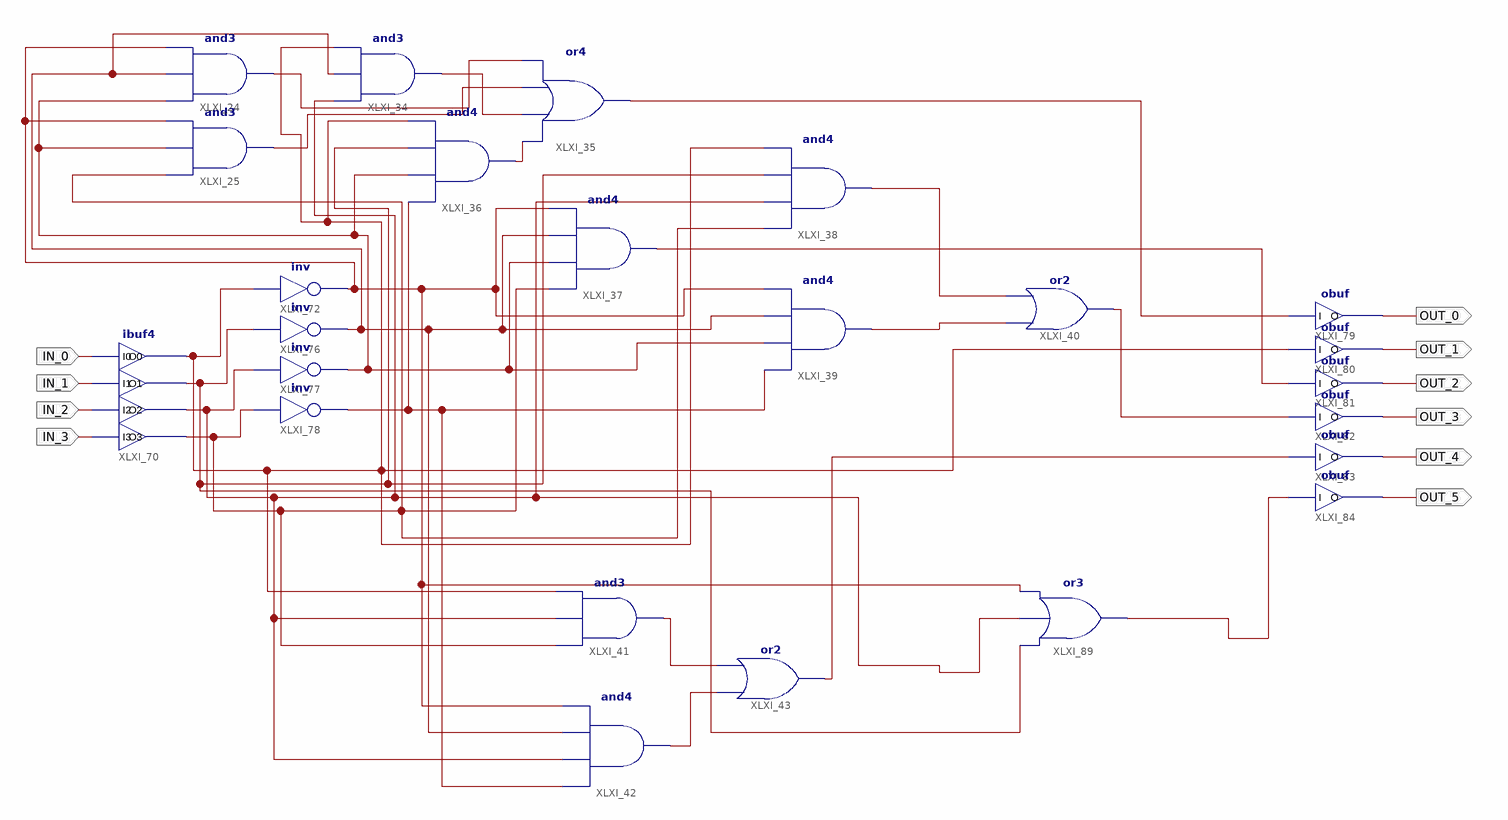
[diagram p0: schematic sheet 1]
// Xilinx ISE schematic My2To4Decoder.sch (spartan3a) as structural Verilog: 24 symbols, 10 ports
module My2To4Decoder (
  input  IN_0,
  input  IN_1,
  input  IN_2,
  input  IN_3,
  output OUT_0,
  output OUT_1,
  output OUT_2,
  output OUT_3,
  output OUT_4,
  output OUT_5
);

  wire XLXN_36, XLXN_37, XLXN_38, XLXN_42, XLXN_44, XLXN_47, XLXN_48, XLXN_57, XLXN_59, XLXN_61, XLXN_64,
       XLXN_67, XLXN_70, XLXN_71, XLXN_72, XLXN_75, XLXN_77, XLXN_78, XLXN_79, XLXN_80, XLXN_101;

  and XLXI_25 (XLXN_48, XLXN_38, XLXN_44, XLXN_101);
  and XLXI_34 (XLXN_57, XLXN_37, XLXN_42, XLXN_80);
  or XLXI_35 (XLXN_64, XLXN_47, XLXN_48, XLXN_57, XLXN_59);
  and XLXI_24 (XLXN_47, XLXN_44, XLXN_42, XLXN_101);
  and XLXI_36 (XLXN_59, XLXN_80, XLXN_36, XLXN_44, XLXN_61);
  and XLXI_37 (XLXN_67, XLXN_101, XLXN_42, XLXN_44, XLXN_38);
  and XLXI_38 (XLXN_70, XLXN_80, XLXN_36, XLXN_37, XLXN_38);
  and XLXI_39 (XLXN_71, XLXN_101, XLXN_42, XLXN_44, XLXN_61);
  or XLXI_40 (XLXN_72, XLXN_71, XLXN_70);
  and XLXI_41 (XLXN_75, XLXN_38, XLXN_37, XLXN_80);
  and XLXI_42 (XLXN_77, XLXN_101, XLXN_42, XLXN_37, XLXN_61);
  or XLXI_43 (XLXN_78, XLXN_77, XLXN_75);
  ibuf4 XLXI_70 (.I0(IN_0), .I1(IN_1), .I2(IN_2), .I3(IN_3), .O0(XLXN_80), .O1(XLXN_36), .O2(XLXN_37), .O3(XLXN_38));
  not XLXI_72 (XLXN_101, XLXN_80);
  not XLXI_76 (XLXN_42, XLXN_36);
  not XLXI_77 (XLXN_44, XLXN_37);
  not XLXI_78 (XLXN_61, XLXN_38);
  obuf XLXI_79 (.I(XLXN_64), .O(OUT_0));
  obuf XLXI_80 (.I(XLXN_80), .O(OUT_1));
  obuf XLXI_81 (.I(XLXN_67), .O(OUT_2));
  obuf XLXI_82 (.I(XLXN_72), .O(OUT_3));
  obuf XLXI_83 (.I(XLXN_78), .O(OUT_4));
  obuf XLXI_84 (.I(XLXN_79), .O(OUT_5));
  or XLXI_89 (XLXN_79, XLXN_36, XLXN_37, XLXN_101);
endmodule
